# EAGLE design M701D (EAGLE 6.6.0)
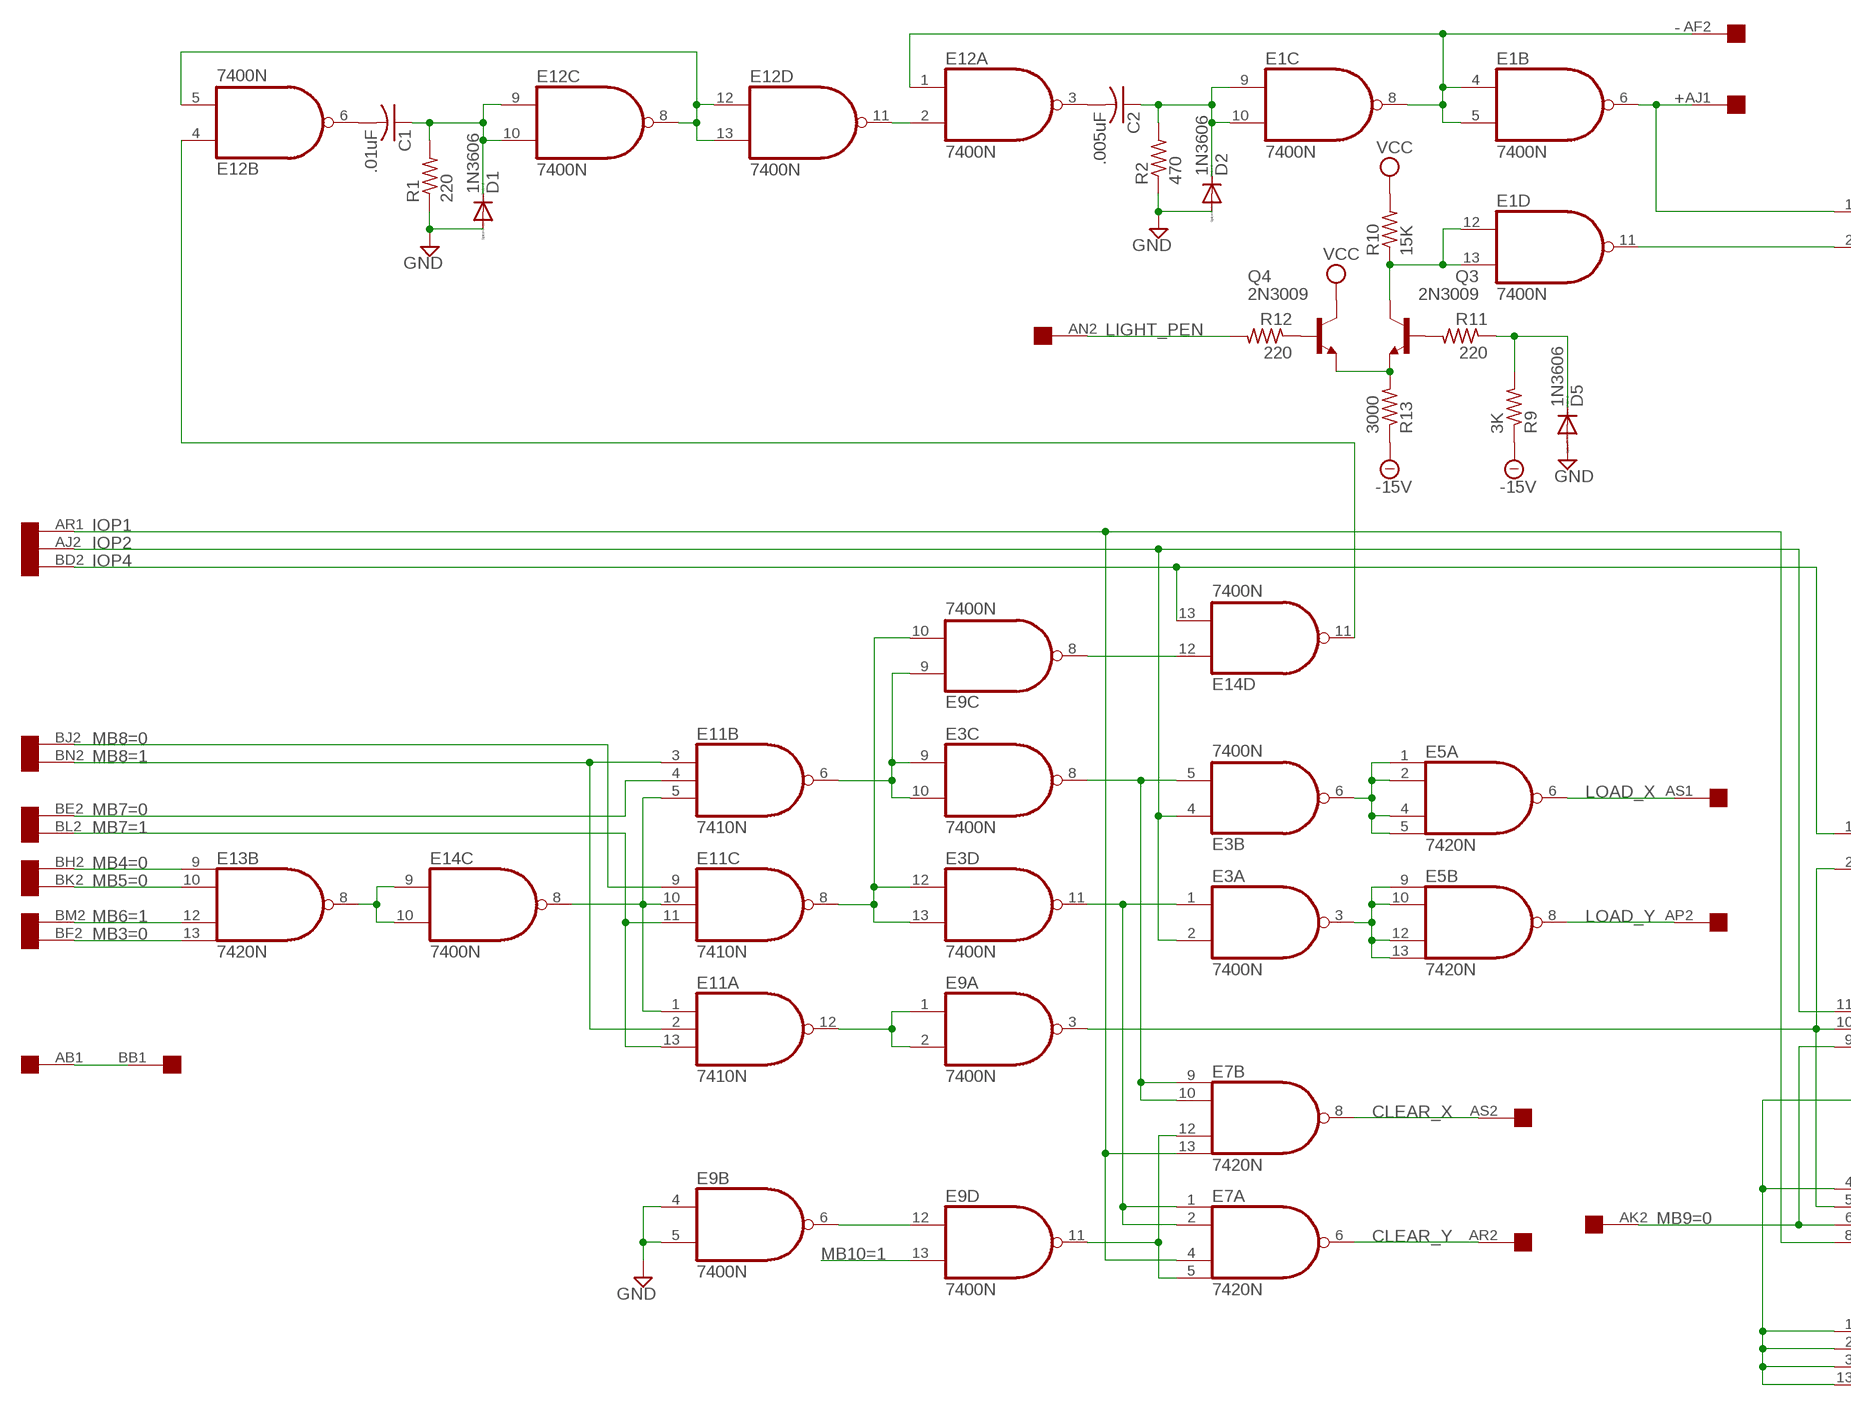
[diagram p0: schematic, sheet 1, part 1 of 2]
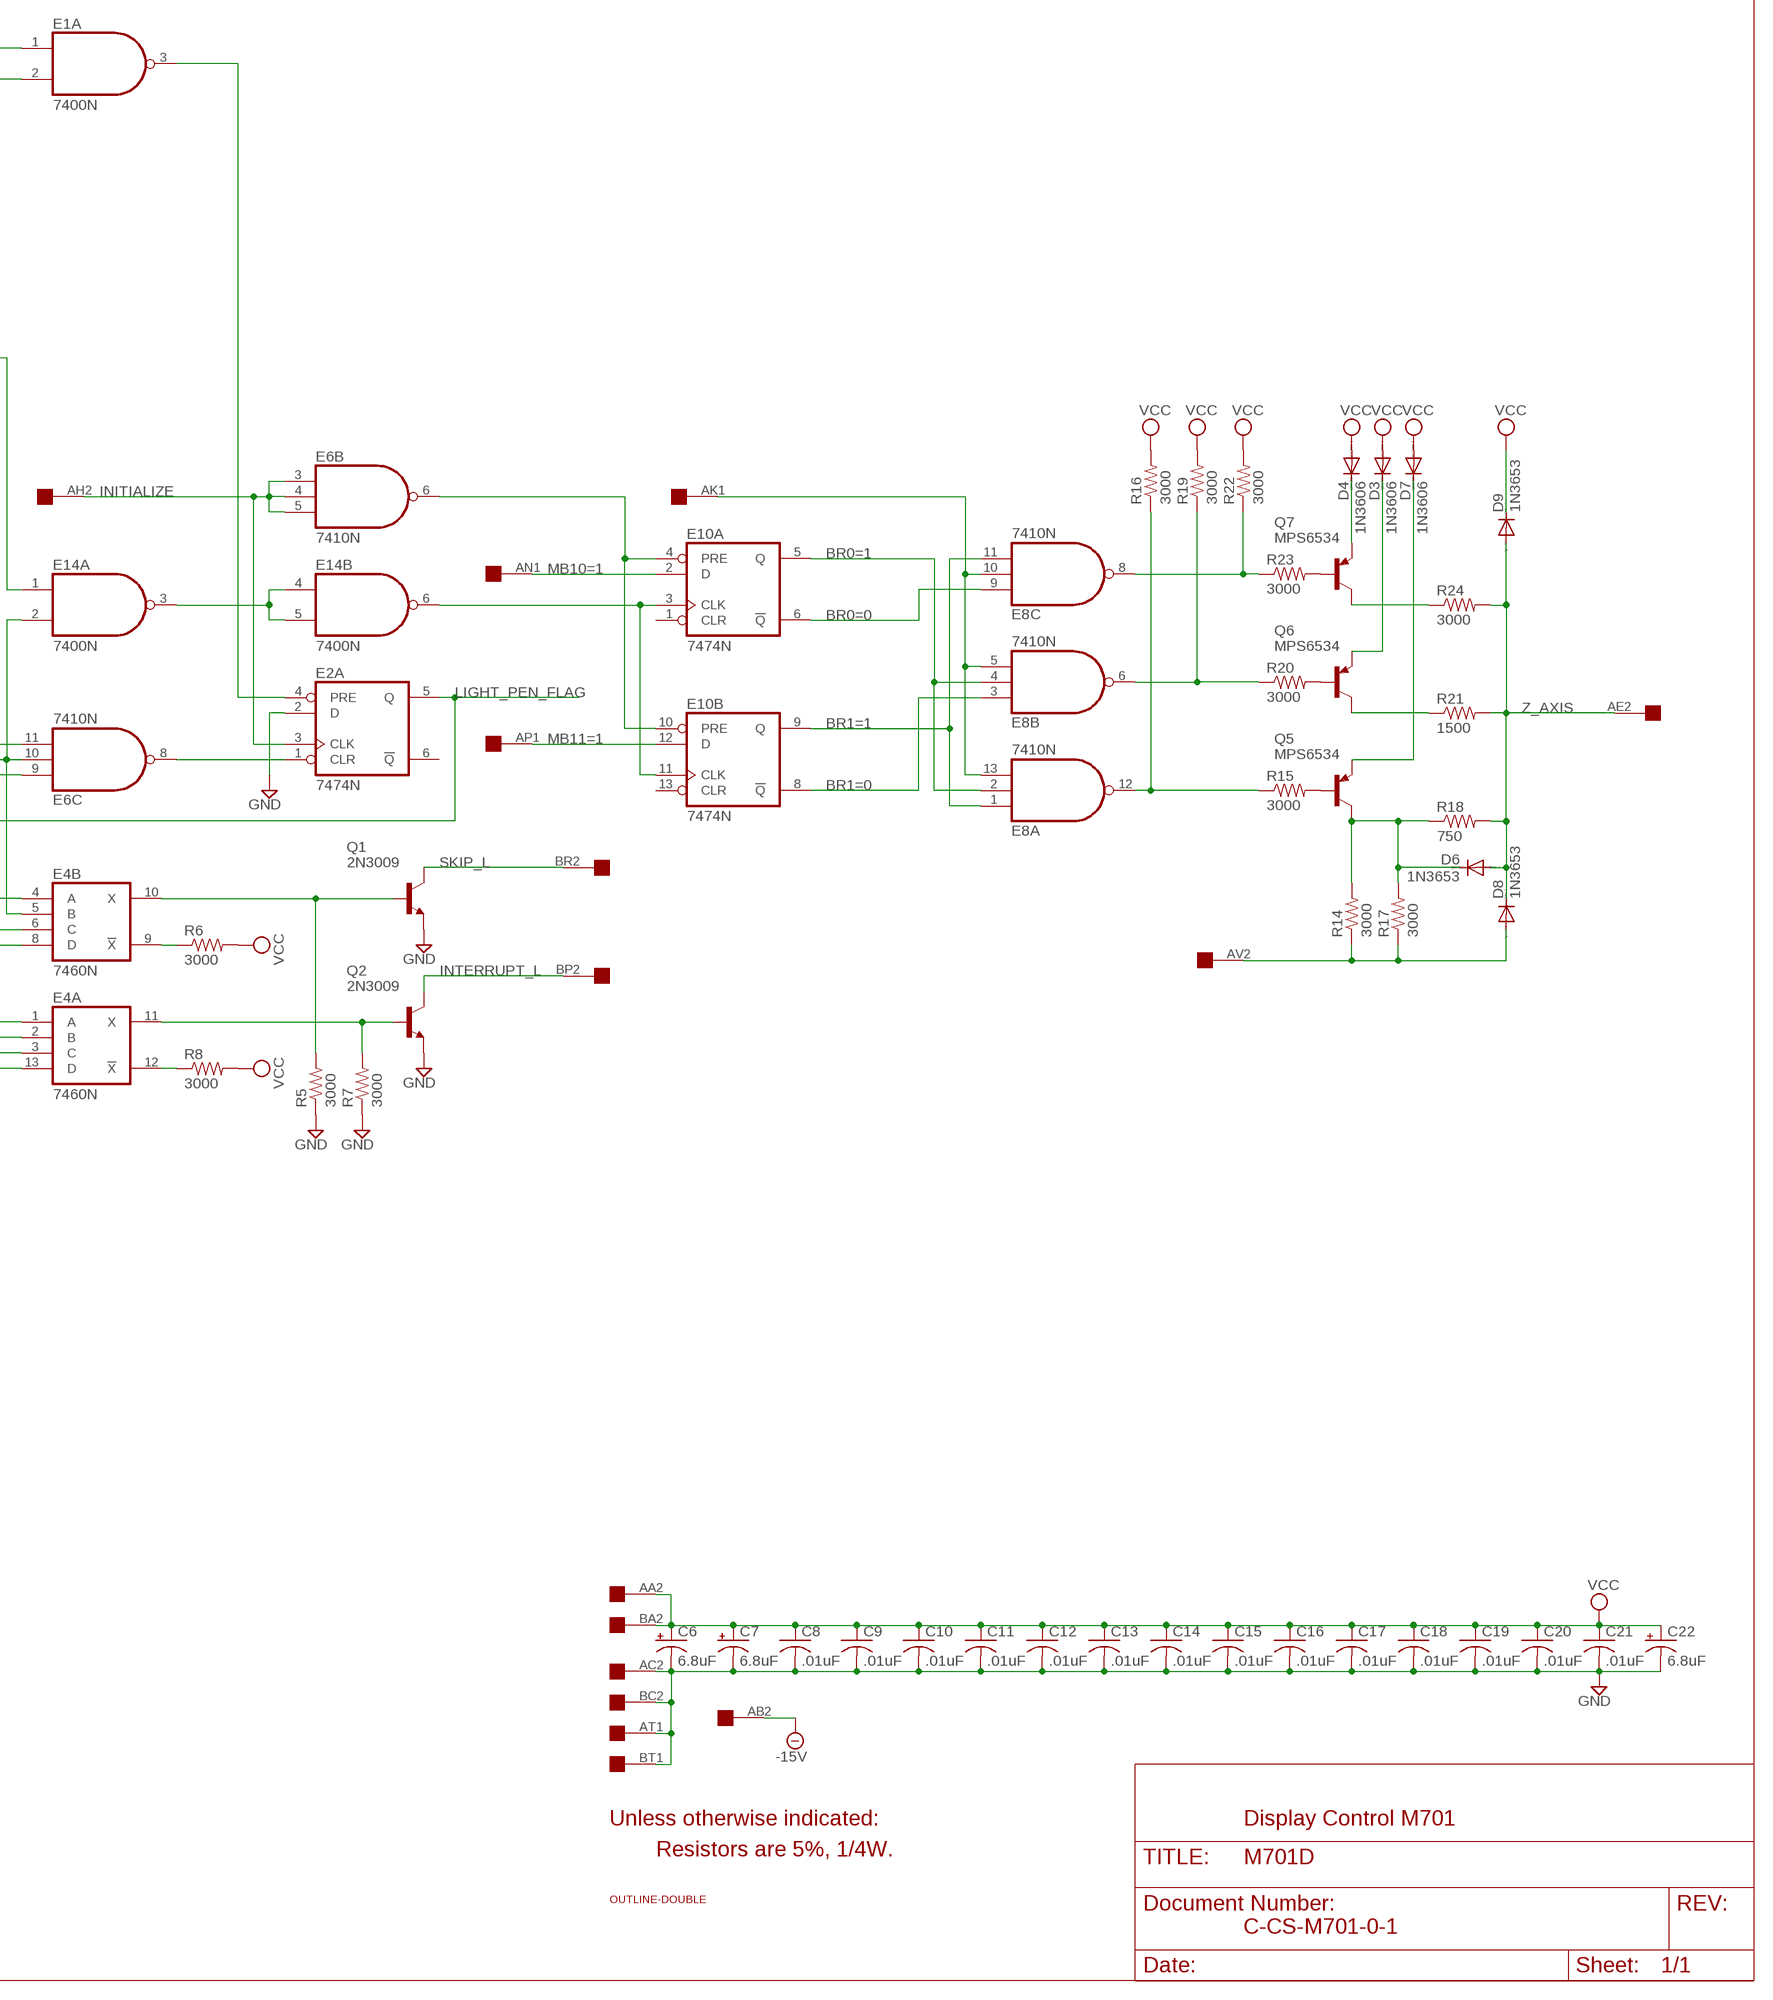
[diagram p1: schematic, sheet 1, part 2 of 2]

## Parts
C1  .01uF  C-US050-025X075  [C050-025X075]
C2  .005uF  C-US050-025X075  [C050-025X075]
C6  6.8uF  CPOL-USE20-8AXIAL  [E12-8]
C7  6.8uF  CPOL-USE20-8AXIAL  [E12-8]
C8  .01uF  C-US050-025X075  [C050-025X075]
C9  .01uF  C-US050-025X075  [C050-025X075]
C10  .01uF  C-US050-025X075  [C050-025X075]
C11  .01uF  C-US050-025X075  [C050-025X075]
C12  .01uF  C-US050-025X075  [C050-025X075]
C13  .01uF  C-US050-025X075  [C050-025X075]
C14  .01uF  C-US050-025X075  [C050-025X075]
C15  .01uF  C-US050-025X075  [C050-025X075]
C16  .01uF  C-US050-025X075  [C050-025X075]
C17  .01uF  C-US050-025X075  [C050-025X075]
C18  .01uF  C-US050-025X075  [C050-025X075]
C19  .01uF  C-US050-025X075  [C050-025X075]
C20  .01uF  C-US050-025X075  [C050-025X075]
C21  .01uF  C-US050-025X075  [C050-025X075]
C22  6.8uF  CPOL-USE20-8AXIAL  [E12-8]
D1  1N3606  1N4148DO35-10  [DO35-10]
D2  1N3606  1N4148DO35-10  [DO35-10]
D3  1N3606  1N4148DO35-10  [DO35-10]
D4  1N3606  1N4148DO35-10  [DO35-10]
D5  1N3606  1N4148DO35-10  [DO35-10]
D6  1N3653  1N4148DO35-10  [DO35-10]
D7  1N3606  1N4148DO35-10  [DO35-10]
D8  1N3653  1N4148DO35-10  [DO35-10]
D9  1N3653  1N4148DO35-10  [DO35-10]
E1  7400N  [DIL14]
E2  7474N  74S74N  [DIL14]
E3  7400N  [DIL14]
E4  7460N  [DIL14]
E5  7420N  74S20N  [DIL14]
E6  7410N  [DIL14]
E7  7420N  74S20N  [DIL14]
E8  7410N  [DIL14]
E9  7400N  [DIL14]
E10  7474N  74S74N  [DIL14]
E11  7410N  [DIL14]
E12  7400N  [DIL14]
E13  7420N  74S20N  [DIL14]
E14  7400N  [DIL14]
Q1  2N3009  2N2102  [TO5]
Q2  2N3009  2N2102  [TO5]
Q3  2N3009  2N2102  [TO5]
Q4  2N3009  2N2102  [TO5]
Q5  MPS6534  2N2905  [TO5]
Q6  MPS6534  2N2905  [TO5]
Q7  MPS6534  2N2905  [TO5]
R1  220  R-US_0207/10  [0207/10]
R2  470  R-US_0207/10  [0207/10]
R5  3000  R-US_0207/10  [0207/10]
R6  3000  R-US_0207/10  [0207/10]
R7  3000  R-US_0207/10  [0207/10]
R8  3000  R-US_0207/10  [0207/10]
R9  3K  R-US_0207/10  [0207/10]
R10  15K  R-US_0207/10  [0207/10]
R11  220  R-US_0207/10  [0207/10]
R12  220  R-US_0207/10  [0207/10]
R13  3000  R-US_0207/10  [0207/10]
R14  3000  R-US_0207/10  [0207/10]
R15  3000  R-US_0207/10  [0207/10]
R16  3000  R-US_0207/10  [0207/10]
R17  3000  R-US_0207/10  [0207/10]
R18  750  R-US_0207/10  [0207/10]
R19  3000  R-US_0207/10  [0207/10]
R20  3000  R-US_0207/10  [0207/10]
R21  1500  R-US_0207/10  [0207/10]
R22  3000  R-US_0207/10  [0207/10]
R23  3000  R-US_0207/10  [0207/10]
R24  3000  R-US_0207/10  [0207/10]
U$1  DOUBLE  [EDGE-CON4]
U$2  OUTLINE-DOUBLE  [DOUBLE]

## Nets
+: E1.1(A:I0) E1.6(B:O) U$1.AJ1
-: E1.4(B:I0) E1.5(B:I1) E1.8(C:O) E12.1(A:I0) U$1.AF2
-15V: R9.1 R13.1 U$1.AB2
BR0=0: E8.9(C:I0) E10.6(A:!Q)
BR0=1: E8.2(A:I1) E8.4(B:I1) E10.5(A:Q)
BR1=0: E8.3(B:I0) E10.8(B:!Q)
BR1=1: E8.1(A:I0) E8.11(C:I2) E10.9(B:Q)
CLEAR_X: E7.8(B:O) U$1.AS2
CLEAR_Y: E7.6(A:O) U$1.AR2
GND [Supply]: C6.- C7.- C8.2 C9.2 C10.2 C11.2 C12.2 C13.2 C14.2 C15.2 C16.2 C17.2 C18.2 C19.2 C20.2 C21.2 C22.- D1.A D2.A D5.A E2.2(A:D) E9.4(B:I0) E9.5(B:I1) Q1.1(E) Q2.1(E) R1.1 R2.1 R5.1 R7.1 U$1.AC2 U$1.AT1 U$1.BC2 U$1.BT1
INITIALIZE: E2.3(A:CLK) E6.3(B:I0) E6.4(B:I1) E6.5(B:I2) U$1.AH2
INTERRUPT_L: Q2.3(C) U$1.BP2
IOP1: E4.8(B:D) E7.4(A:I2) E7.13(B:I3) U$1.AR1
IOP2: E3.2(A:I1) E3.4(B:I0) E6.11(C:I2) U$1.AJ2
IOP4: E14.1(A:I0) E14.13(D:I1) U$1.BD2
LIGHT_PEN: R12.2 U$1.AN2
LIGHT_PEN_FLAG: E2.5(A:Q) E4.1(A:A) E4.2(A:B) E4.3(A:C) E4.4(B:A) E4.13(A:D)
LOAD_X: E5.6(A:O) U$1.AS1
LOAD_Y: E5.8(B:O) U$1.AP2
MB3=0: E13.13(B:I3) U$1.BF2
MB4=0: E13.9(B:I0) U$1.BH2
MB5=0: E13.10(B:I1) U$1.BK2
MB6=1: E13.12(B:I2) U$1.BM2
MB7=0: E11.4(B:I1) U$1.BE2
MB7=1: E11.11(C:I2) E11.13(A:I2) U$1.BL2
MB8=0: E11.9(C:I0) U$1.BJ2
MB8=1: E11.2(A:I1) E11.3(B:I0) U$1.BN2
MB9=0: E4.6(B:C) E6.9(C:I0) U$1.AK2
MB10=1: E9.13(D:I1) E10.2(A:D) U$1.AN1
MB11=1: E10.12(B:D) U$1.AP1
N$1: E13.8(B:O) E14.9(C:I0) E14.10(C:I1)
N$2: E11.1(A:I0) E11.5(B:I2) E11.10(C:I1) E14.8(C:O)
N$3: E9.1(A:I0) E9.2(A:I1) E11.12(A:O)
N$4: E3.12(D:I0) E3.13(D:I1) E9.10(C:I1) E11.8(C:O)
N$5: E3.9(C:I0) E3.10(C:I1) E9.9(C:I0) E11.6(B:O)
N$6: E3.5(B:I1) E3.8(C:O) E7.9(B:I0) E7.10(B:I1)
N$7: E3.1(A:I0) E3.11(D:O) E7.1(A:I0) E7.2(A:I1)
N$8: E4.12(A:!X) R8.1
N$9: E3.6(B:O) E5.1(A:I0) E5.2(A:I1) E5.4(A:I2) E5.5(A:I3)
N$10: E3.3(A:O) E5.9(B:I0) E5.10(B:I1) E5.12(B:I2) E5.13(B:I3)
N$11: E9.8(C:O) E14.12(D:I0)
N$12: E14.3(A:O) E14.4(B:I0) E14.5(B:I1)
N$13: E1.3(A:O) E2.4(A:PRE)
N$14: E1.12(D:I0) E1.13(D:I1) Q3.3(C) R10.1
N$15: E4.5(B:B) E6.10(C:I1) E9.3(A:O) E14.2(A:I1)
N$16: E2.1(A:CLR) E6.8(C:O)
N$17: Q3.1(E) Q4.1(E) R13.2
N$18: E4.9(B:!X) R6.1
N$19: E4.10(B:X) Q1.2(B) R5.2
N$20: E4.11(A:X) Q2.2(B) R7.2
N$21: E10.3(A:CLK) E10.11(B:CLK) E14.6(B:O)
N$22: E6.6(B:O) E10.4(A:PRE) E10.10(B:PRE)
N$23: Q3.2(B) R11.2
N$24: E8.5(B:I2) E8.10(C:I1) E8.13(A:I2) U$1.AK1
N$25: E1.2(A:I1) E1.11(D:O)
N$26: C2.1 D2.C E1.9(C:I0) E1.10(C:I1) R2.2
N$27: C2.2 E12.3(A:O)
N$28: D5.C R9.2 R11.1
N$29: Q4.2(B) R12.1
N$30: E12.2(A:I1) E12.11(D:O)
N$31: E12.5(B:I1) E12.8(C:O) E12.12(D:I0) E12.13(D:I1)
N$32: C1.1 D1.C E12.9(C:I0) E12.10(C:I1) R1.2
N$33: C1.2 E12.6(B:O)
N$34: Q7.2(B) R23.2
N$35: Q6.2(B) R20.2
N$36: E12.4(B:I0) E14.11(D:O)
N$37: Q5.2(B) R15.2
N$38: E8.12(A:O) R15.1 R16.1
N$39: E8.6(B:O) R19.1 R20.1
N$40: E8.8(C:O) R22.1 R23.1
N$41: D4.C Q7.1(E)
N$42: D3.C Q6.1(E)
N$43: D7.C Q5.1(E)
N$44: D6.C Q5.3(C) R14.2 R17.2 R18.1
N$45: Q6.3(C) R21.1
N$46: Q7.3(C) R24.1
N$47: E7.5(A:I3) E7.12(B:I2) E9.11(D:O)
N$48: D8.A R14.1 R17.1 U$1.AV2
N$49: E9.6(B:O) E9.12(D:I0)
N$50: U$1.AB1 U$1.BB1
SKIP_L: Q1.3(C) U$1.BR2
VCC [Supply]: C6.+ C7.+ C8.1 C9.1 C10.1 C11.1 C12.1 C13.1 C14.1 C15.1 C16.1 C17.1 C18.1 C19.1 C20.1 C21.1 C22.+ D3.A D4.A D7.A D9.C Q4.3(C) R6.2 R8.2 R10.2 R16.2 R19.2 R22.2 U$1.AA2 U$1.BA2
Z_AXIS: D6.A D8.C D9.A R18.2 R21.2 R24.2 U$1.AE2
Unconnected: E2.6(A:!Q) E2.8(B:!Q) E2.9(B:Q) E2.10(B:PRE) E2.11(B:CLK) E2.12(B:D) E2.13(B:CLR) E6.1(A:I0) E6.2(A:I1) E6.12(A:O) E6.13(A:I2) E10.1(A:CLR) E10.13(B:CLR) E13.1(A:I0) E13.2(A:I1) E13.4(A:I2) E13.5(A:I3) E13.6(A:O) U$1.AA1 U$1.AC1 U$1.AD1 U$1.AD2 U$1.AE1 U$1.AF1 U$1.AH1 U$1.AL1 U$1.AL2 U$1.AM1 U$1.AM2 U$1.AT2 U$1.AU1 U$1.AU2 U$1.AV1 U$1.BA1 U$1.BB2 U$1.BC1 U$1.BD1 U$1.BE1 U$1.BF1 U$1.BH1 U$1.BJ1 U$1.BK1 U$1.BL1 U$1.BM1 U$1.BN1 U$1.BP1 U$1.BR1 U$1.BS1 U$1.BS2 U$1.BT2 U$1.BU1 U$1.BU2 U$1.BV1 U$1.BV2

## Notes on the sheet
- Unless otherwise indicated: | Display Control M701
- Resistors are 5%, 1/4W.
- C-CS-M701-0-1

## Power pins joined to a net without a drawn wire
GND: E1.7(P:GND) E2.7(P:GND) E3.7(P:GND) E4.7(P:GND) E5.7(P:GND) E6.7(P:GND) E7.7(P:GND) E8.7(P:GND) E9.7(P:GND) E10.7(P:GND) E11.7(P:GND) E12.7(P:GND) E13.7(P:GND) E14.7(P:GND)
VCC: E1.14(P:VCC) E2.14(P:VCC) E3.14(P:VCC) E4.14(P:VCC) E5.14(P:VCC) E6.14(P:VCC) E7.14(P:VCC) E8.14(P:VCC) E9.14(P:VCC) E10.14(P:VCC) E11.14(P:VCC) E12.14(P:VCC) E13.14(P:VCC) E14.14(P:VCC)

## Library data of the parts
C1 C2 C8-C21 = rcl:C-US: CAPACITOR, American symbol
C6 C7 C22 = dec-con:CPOL-USE20-8AXIAL: A 0.8 inch electrolytic.
D1-D9 = diode:1N4148: DIODE high speed (Philips)
E1 E3 E9 E12 E14 = 74xx-us:74*00: Quad 2-input NAND gate
E2 E10 = 74xx-us:74*74: Dual D type positive edge triggered FLIP FLOP, preset and clear
E4 = 74xx-us:74*60: Dual 4-input EXPANDER
E5 E7 E13 = 74xx-us:74*20: Dual 4-input NAND gate
E6 E8 E11 = 74xx-us:74*10: Triple 3-input NAND gate
Q1-Q4 = transistor-npn:2N2102: NPN Transistor
Q5-Q7 = transistor-pnp:2N2905: PNP Transistor
R1 R2 R5-R24 = rcl:R-US_: RESISTOR, American symbol
U$1 = dec-con:DOUBLE: Double-Height DEC board
U$2 = dec-con:OUTLINE-*: Board outlines for DEC boards.

## Net classes
1 Supply: width 0.813 mm

## Board
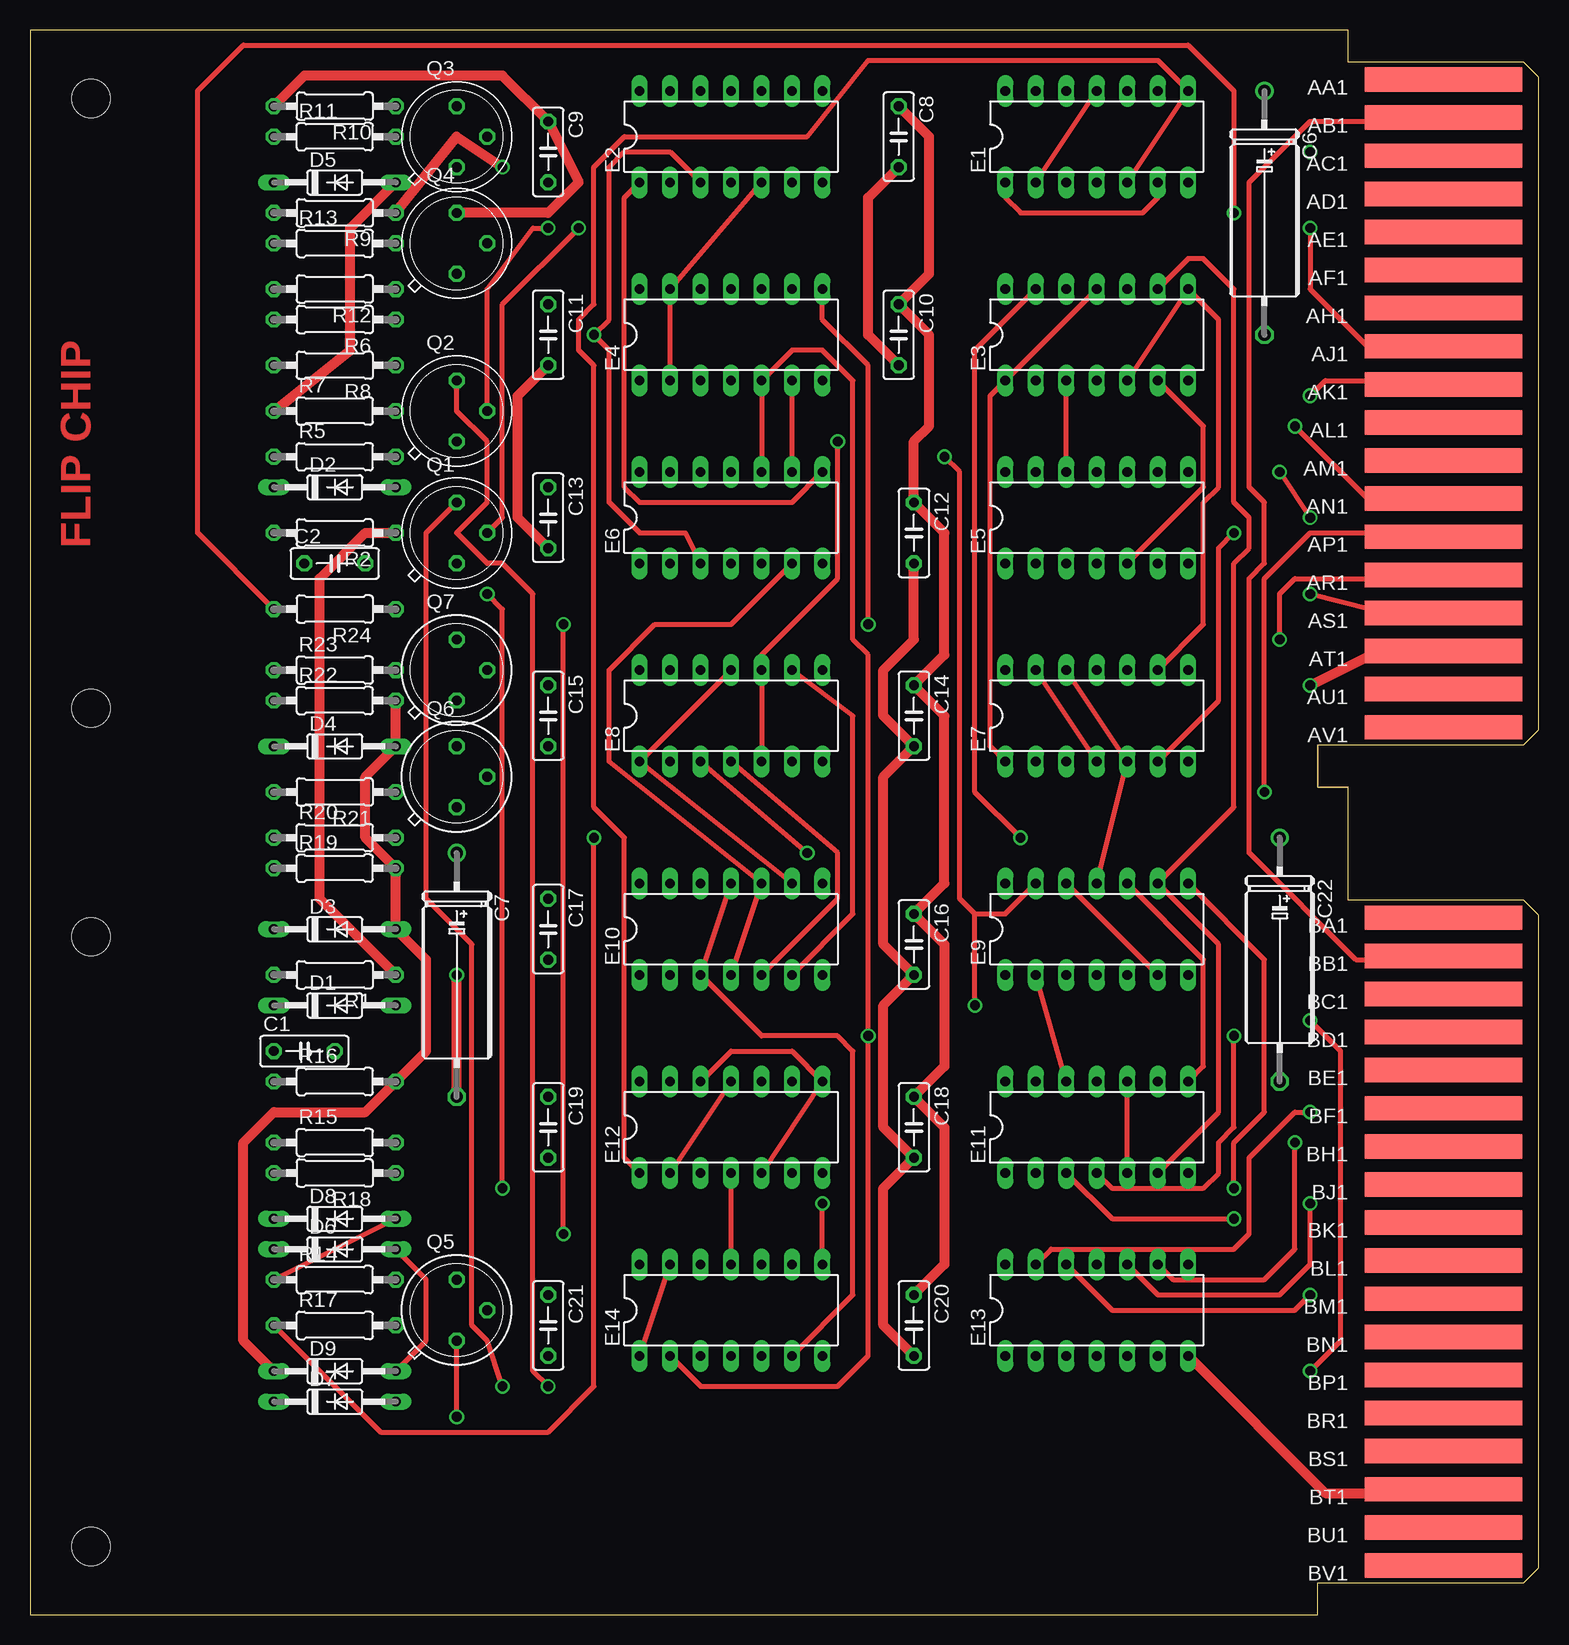
[diagram p2: board, top side]
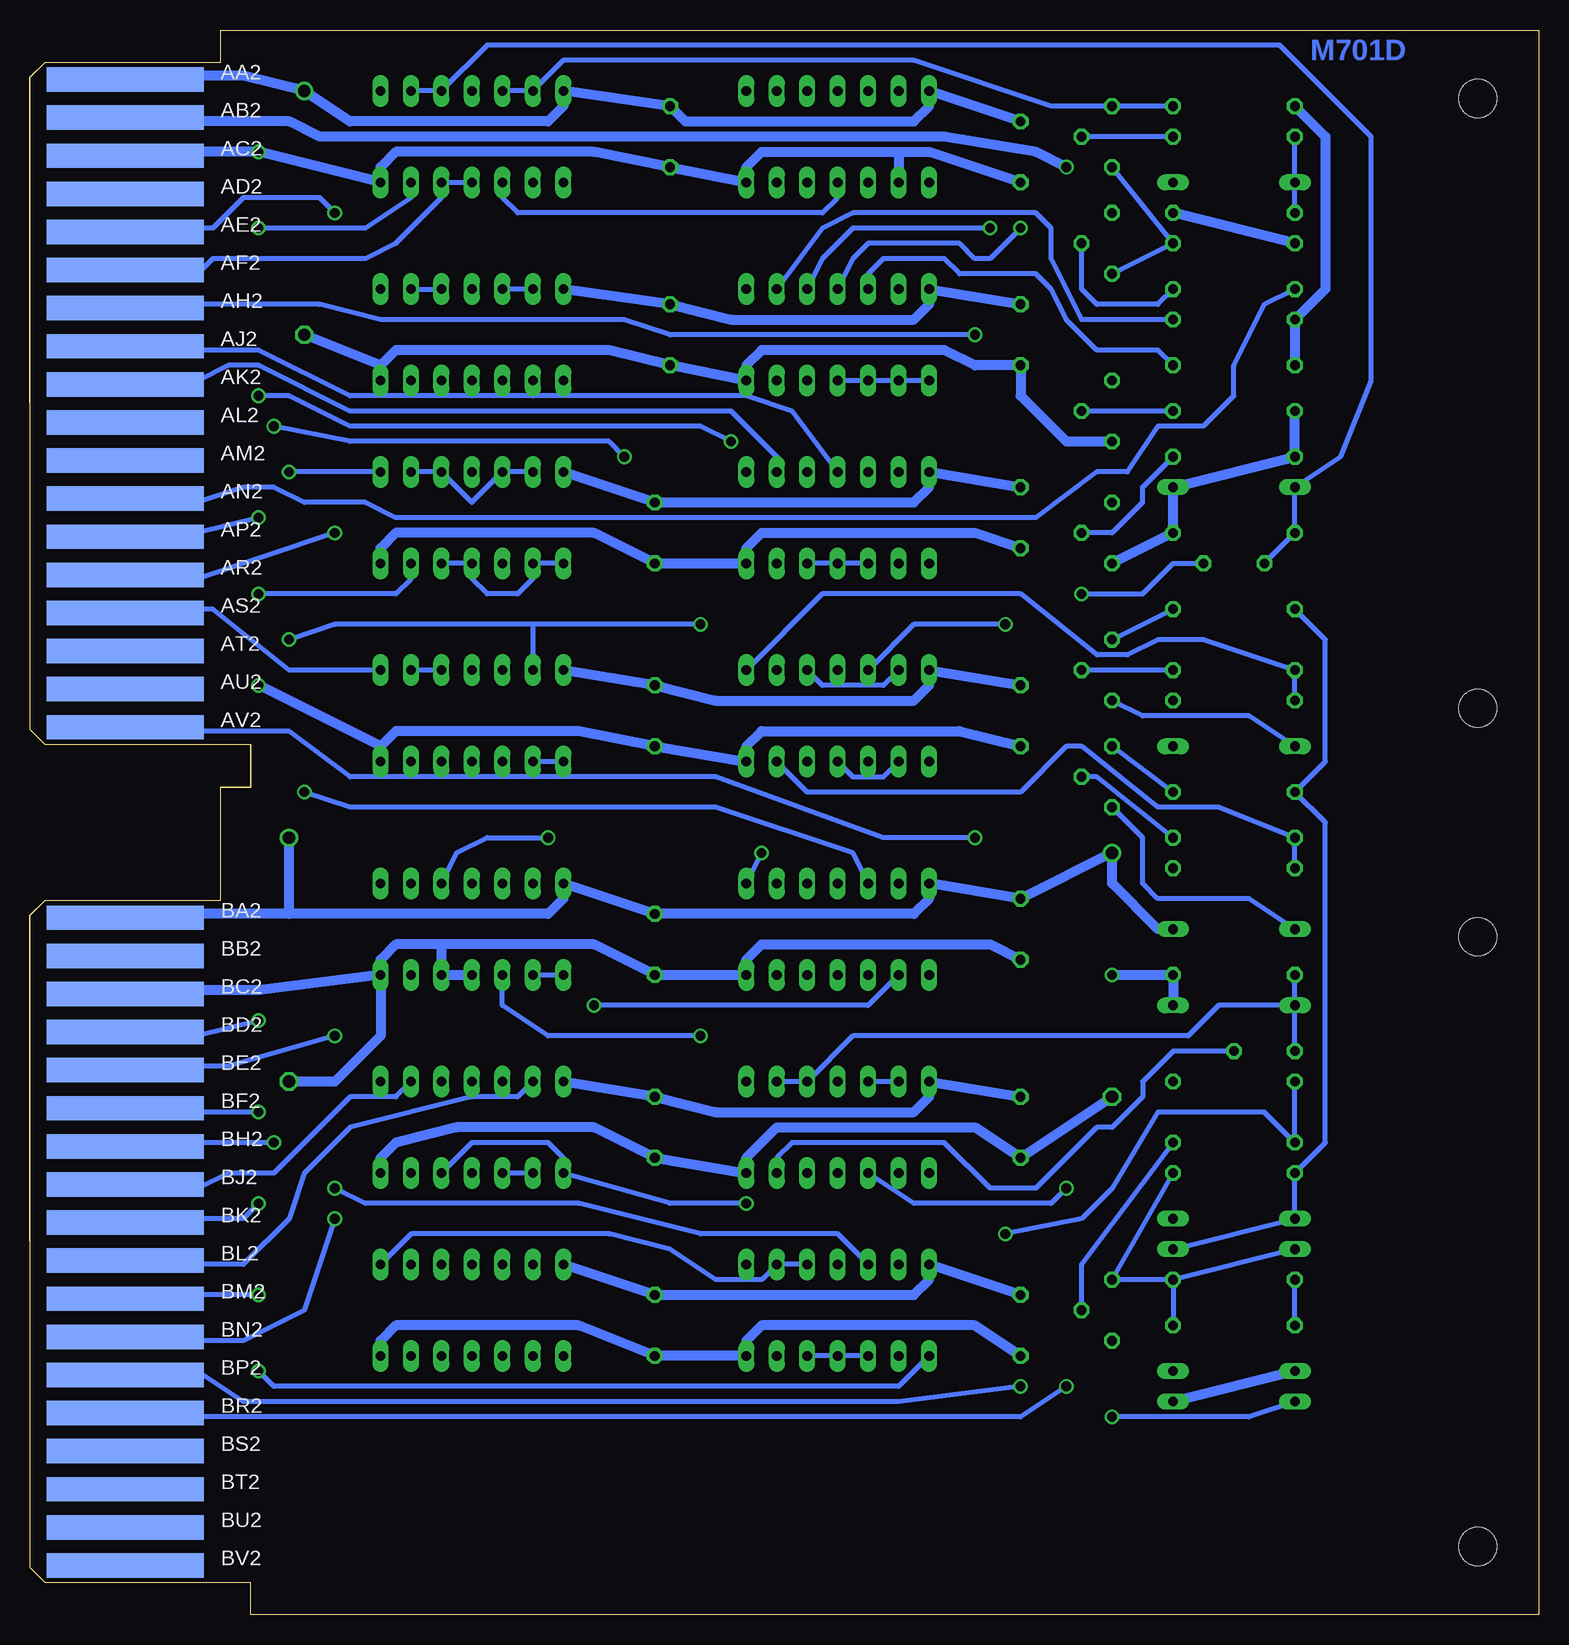
[diagram p3: board, bottom side, seen from below]

Size 125.73 x 132.08 mm. Coordinates in mm from the lower left corner, seen from the top.
Copper layers (1+16): Top 0.035mm / dielectric 1.5mm / Bottom 0.035mm
Design rules "16mils": minimum track width 16mil, minimum drill 32mil, track to track 15mil, track to pad 10mil, pad to pad 10mil, via to via 10mil, smd to smd 10mil, copper to edge 13mil, drill to drill 10mil, minimum pad ring 10mil, minimum via ring 8mil, stop-mask expansion 0mil, vias tented up to drill 0mil, thermal gap 10mil

### Footprints (pad centres in the part's own frame; a part is rotated, then mirrored left to right if it is on the bottom)
C050-025X075 = drill 0.813 octagon: 1 -2.54,0; 2 2.54,0
E12-8 = drill 1.016: + -10.16,0 | drill 1.016 octagon: - 10.16,0
DO35-10 = drill 0.813 long: A 5.08,0; C -5.08,0
DIL14 = drill 0.813 long: 1 -7.62,-3.81; 2 -5.08,-3.81; 3 -2.54,-3.81; 4 0,-3.81; 5 2.54,-3.81; 6 5.08,-3.81; 7 7.62,-3.81; 8 7.62,3.81; 9 5.08,3.81; 10 2.54,3.81; 11 0,3.81; 12 -2.54,3.81; 13 -5.08,3.81; 14 -7.62,3.81
TO5 = drill 0.813 octagon: 1 0,-2.54; 2 2.54,0; 3 0,2.54
0207/10 = drill 0.813 octagon: 1 -5.08,0; 2 5.08,0
EDGE-CON4 = smd 13.106 x 2.032: AA1 7.938,4.128; AB1 7.938,7.303; AC1 7.938,10.477; AD1 7.938,13.652; AE1 7.938,16.828; AF1 7.938,20.003; AH1 7.938,23.177; AJ1 7.938,26.352; AK1 7.938,29.527; AL1 7.938,32.703; AM1 7.938,35.877; AN1 7.938,39.053; AP1 7.938,42.227; AR1 7.938,45.403; AS1 7.938,48.578; AT1 7.938,51.752; AU1 7.938,54.928; AV1 7.938,58.102; BA1 7.938,73.978; BB1 7.938,77.153; BC1 7.938,80.328; BD1 7.938,83.502; BE1 7.938,86.677; BF1 7.938,89.853; BH1 7.938,93.028; BJ1 7.938,96.203; BK1 7.938,99.377; BL1 7.938,102.552; BM1 7.938,105.728; BN1 7.938,108.903; BP1 7.938,112.078; BR1 7.938,115.252; BS1 7.938,118.427; BT1 7.938,121.603; BU1 7.938,124.778; BV1 7.938,127.953 | smd 13.106 x 2.032 bottom: AA2 7.938,4.128; AB2 7.938,7.303; AC2 7.938,10.477; AD2 7.938,13.652; AE2 7.938,16.828; AF2 7.938,20.003; AH2 7.938,23.177; AJ2 7.938,26.352; AK2 7.938,29.527; AL2 7.938,32.703; AM2 7.938,35.877; AN2 7.938,39.053; AP2 7.938,42.227; AR2 7.938,45.403; AS2 7.938,48.578; AT2 7.938,51.752; AU2 7.938,54.928; AV2 7.938,58.102; BA2 7.938,73.978; BB2 7.938,77.153; BC2 7.938,80.328; BD2 7.938,83.502; BE2 7.938,86.677; BF2 7.938,89.853; BH2 7.938,93.028; BJ2 7.938,96.203; BK2 7.938,99.377; BL2 7.938,102.552; BM2 7.938,105.728; BN2 7.938,108.903; BP2 7.938,112.078; BR2 7.938,115.252; BS2 7.938,118.427; BT2 7.938,121.603; BU2 7.938,124.778; BV2 7.938,127.953
DOUBLE = hole 3.175: 120.65,56.515; 120.65,5.715; 120.65,75.565; 120.65,126.365

### Placement (x,y rotation side)
C1  22.86,46.99 0 top
C2  25.4,87.63 0 top
C6  102.87,116.84 270 top
C7  35.56,53.34 270 top
C8  72.39,123.19 270 top
C9  43.18,121.92 270 top
C10  72.39,106.68 270 top
C11  43.18,106.68 270 top
C12  73.66,90.17 270 top
C13  43.18,91.44 270 top
C14  73.66,74.93 270 top
C15  43.18,74.93 270 top
C16  73.66,55.88 270 top
C17  43.18,57.15 270 top
C18  73.66,40.64 270 top
C19  43.18,40.64 270 top
C20  73.66,24.13 270 top
C21  43.18,24.13 270 top
C22  104.14,54.61 270 top
D1  25.4,50.8 0 top
D2  25.4,93.98 0 top
D3  25.4,57.15 0 top
D4  25.4,72.39 0 top
D5  25.4,119.38 0 top
D6  25.4,30.48 0 top
D7  25.4,17.78 0 top
D8  25.4,33.02 0 top
D9  25.4,20.32 0 top
E1  88.9,123.19 0 top
E2  58.42,123.19 0 top
E3  88.9,106.68 0 top
E4  58.42,106.68 0 top
E5  88.9,91.44 0 top
E6  58.42,91.44 0 top
E7  88.9,74.93 0 top
E8  58.42,74.93 0 top
E9  88.9,57.15 0 top
E10  58.42,57.15 0 top
E11  88.9,40.64 0 top
E12  58.42,40.64 0 top
E13  88.9,25.4 0 top
E14  58.42,25.4 0 top
Q1  35.56,90.17 0 top
Q2  35.56,100.33 0 top
Q3  35.56,123.19 0 top
Q4  35.56,114.3 0 top
Q5  35.56,25.4 0 top
Q6  35.56,69.85 0 top
Q7  35.56,78.74 0 top
R1  25.4,53.34 180 top
R2  25.4,90.17 180 top
R5  25.4,96.52 0 top
R6  25.4,107.95 180 top
R7  25.4,100.33 0 top
R8  25.4,104.14 180 top
R9  25.4,116.84 180 top
R10  25.4,125.73 180 top
R11  25.4,123.19 0 top
R12  25.4,110.49 180 top
R13  25.4,114.3 0 top
R14  25.4,27.94 0 top
R15  25.4,39.37 0 top
R16  25.4,44.45 0 top
R17  25.4,24.13 0 top
R18  25.4,36.83 180 top
R19  25.4,62.23 0 top
R20  25.4,64.77 0 top
R21  25.4,68.58 180 top
R22  25.4,76.2 0 top
R23  25.4,78.74 0 top
R24  25.4,83.82 180 top
U$1  125.73,132.08 180 top
U$2  125.73,132.08 180 top
U$4  [FLIPCHIP]  0,69.85 0 top

### Tracks (layer width: path | path; a pad name or v marks a point on that pad's centre or on a via)
+  (via drill 0.81)
  Top 0.406: U$1.AJ1 116.84,105.41 111.76,105.41 106.68,110.49 v106.68,115.57 | E1.1 81.28,118.11 82.55,116.84 92.71,116.84 93.98,118.11 E1.6
  Bottom 0.406: E1.6 93.98,118.11 97.79,115.57 v106.68,115.57
-
  Top 0.406: E12.1 49.53,38.1 49.53,64.77 46.99,67.31 46.99,104.14 45.72,105.41 45.72,107.95 46.99,109.22 46.99,120.65 49.53,123.19 64.77,123.19 69.85,129.54 93.98,129.54 E1.8 E1.5
  Bottom 0.406: U$1.AF2 116.84,111.76 111.76,111.76 110.49,113.03 97.79,113.03 95.25,114.3 91.44,118.11 E1.5 E1.4
-15V  (via drill 0.81)
  Top 0.813: R9.1 35.56,123.19 v39.37,120.65
  Bottom 0.813: U$1.AB2 116.84,124.46 104.14,124.46 101.6,123.19 49.53,123.19 41.91,121.92 v39.37,120.65 | R13.1 R9.1
BR0=0
  Top 0.406: E10.6 68.58,58.42 68.58,74.93 E8.9
BR0=1
  Top 0.406: E10.5 67.31,59.69 67.31,63.5 E8.4
  Bottom 0.406: E8.2 54.61,69.85 57.15,69.85 E8.4
BR1=0  (via drill 0.81)
  Top 0.406: E8.3 v64.77,63.5
  Bottom 0.406: v64.77,63.5 E10.8
BR1=1
  Top 0.406: E10.9 E8.1 E8.11
CLEAR_X
  Bottom 0.406: E7.8 104.14,78.74 110.49,83.82 116.84,83.82 U$1.AS2
CLEAR_Y  (via drill 0.81)
  Top 0.406: E7.6 99.06,76.2 99.06,88.9 v100.33,90.17
  Bottom 0.406: U$1.AR2 116.84,86.36 111.76,86.36 v100.33,90.17
GND  (via drill 0.81)
  Top 0.813: D5.A 26.67,115.57 26.67,105.41 R7.1 | C10.2 69.85,106.68 69.85,118.11 C8.2 | C12.2 73.66,81.28 71.12,78.74 71.12,74.93 C14.2 71.12,69.85 71.12,55.88 C16.2 71.12,50.8 71.12,40.64 C18.2 71.12,35.56 71.12,24.13 C20.2 | U$1.BT1 116.84,10.16 107.95,10.16 E13.7 | C7.- v35.56,53.34 | U$1.AT1 116.84,80.01 111.76,80.01 v106.68,77.47 | C13.2 40.64,91.44 40.64,101.6 C11.2 | R2.1 27.94,90.17 24.13,86.36 24.13,59.69 R1.1
  Bottom 0.813: Q2.1 39.37,97.79 43.18,101.6 C11.2 46.99,104.14 49.53,105.41 64.77,105.41 66.04,104.14 E4.7 C10.2 77.47,105.41 95.25,105.41 96.52,104.14 | 96.52,104.14 E3.7 | 96.52,104.14 C6.- | C9.2 50.8,121.92 53.34,121.92 | 53.34,121.92 64.77,121.92 66.04,120.65 E2.7 C8.2 78.74,121.92 95.25,121.92 96.52,120.65 E1.7 v106.68,121.92 116.84,121.92 U$1.AC2 | 53.34,121.92 E2.2 | C7.- C19.2 46.99,40.64 63.5,40.64 66.04,38.1 E12.7 C18.2 78.74,40.64 90.17,40.64 95.25,39.37 96.52,38.1 E11.7 | C13.2 46.99,90.17 64.77,90.17 66.04,88.9 E6.7 C12.2 78.74,90.17 95.25,90.17 96.52,88.9 E5.7 | C17.2 45.72,55.88 64.77,55.88 66.04,54.61 E10.7 C16.2 78.74,55.88 91.44,55.88 | E13.7 96.52,22.86 95.25,24.13 80.01,24.13 C20.2 E14.7 66.04,22.86 64.77,24.13 46.99,24.13 C21.2 | E9.7 96.52,54.61 95.25,55.88 91.44,55.88 | 91.44,55.88 E9.5 E9.4 | C22.- 100.33,44.45 96.52,48.26 E9.7 | U$1.BC2 116.84,52.07 106.68,52.07 E9.7 | 96.52,72.39 E7.7 | 96.52,72.39 95.25,73.66 80.01,73.66 C14.2 E8.7 66.04,72.39 64.77,73.66 48.26,73.66 C15.2 | Q1.1 R2.1 D2.A R5.1 R7.1 | D1.A R1.1 v35.56,53.34 | 96.52,72.39 v106.68,77.47
INITIALIZE  (via drill 0.81)
  Top 0.406: E2.3 53.34,121.92 49.53,121.92 48.26,120.65 48.26,107.95 v46.99,106.68 48.26,105.41 48.26,92.71 50.8,90.17 54.61,90.17 E6.3
  Bottom 0.406: U$1.AH2 116.84,109.22 101.6,109.22 96.52,107.95 76.2,107.95 72.39,106.68 v46.99,106.68 | E6.3 E6.4 E6.5
INTERRUPT_L  (via drill 0.81)
  Top 0.406: v43.18,19.05 41.91,20.32 41.91,85.09 39.37,87.63 38.1,87.63 35.56,90.17 38.1,92.71 38.1,97.79 35.56,100.33 Q2.3
  Bottom 0.406: U$1.BP2 117.17,19.99 116.84,20.32 111.76,20.32 107.95,17.78 53.34,17.78 v43.18,19.05
IOP1  (via drill 0.81)
  Top 0.406: E4.8 66.04,107.95 69.85,104.14 v69.85,82.55 | E7.13 E7.4 | U$1.AR1 116.84,86.36 105.41,86.36 104.14,85.09 v104.14,81.28
  Bottom 0.406: v69.85,82.55 83.82,82.55 | 83.82,82.55 E7.13 | 83.82,82.55 100.33,82.55 v104.14,81.28
IOP2
  Bottom 0.406: U$1.AJ2 116.84,105.41 106.68,105.41 99.06,101.6 88.9,101.6 | 88.9,101.6 E3.4 | 83.82,101.6 E3.2 | 83.82,101.6 88.9,101.6 | 83.82,101.6 66.04,101.6 62.23,100.33 E6.11
IOP4  (via drill 0.81)
  Top 0.406: E14.1 E14.13 | v106.68,20.32 109.22,22.86 109.22,46.99 v106.68,49.53
  Bottom 0.406: E14.1 53.34,19.05 105.41,19.05 v106.68,20.32 | U$1.BD2 116.84,48.26 111.76,48.26 v106.68,49.53
LIGHT_PEN
  Bottom 0.406: U$1.AN2 116.84,92.71 111.76,92.71 107.95,93.98 105.41,93.98 102.87,92.71 97.79,92.71 95.25,91.44 41.91,91.44 36.83,95.25 34.29,95.25 31.75,99.06 27.94,99.06 25.4,101.6 25.4,104.14 22.86,109.22 R12.2
LIGHT_PEN_FLAG
  Top 0.406: E2.5 E4.13 E4.2
  Bottom 0.406: E4.1 E4.2 E4.3 E4.4
LOAD_X  (via drill 0.81)
  Top 0.406: U$1.AS1 116.84,83.82 111.76,83.82 v106.68,85.09
  Bottom 0.406: E5.6 93.98,86.36 95.25,85.09 v106.68,85.09
LOAD_Y  (via drill 0.81)
  Top 0.406: v104.14,95.25 v106.68,91.44
  Bottom 0.406: U$1.AP2 116.84,90.17 111.76,90.17 v106.68,91.44 | E5.8 v104.14,95.25
MB3=0  (via drill 0.81)
  Top 0.406: E13.13 85.09,30.48 100.33,30.48 101.6,31.75 101.6,38.1 105.41,41.91 v106.68,41.91
  Bottom 0.406: U$1.BF2 116.84,41.91 v106.68,41.91
MB4=0  (via drill 0.81)
  Top 0.406: E13.9 95.25,27.94 102.87,27.94 105.41,30.48 v105.41,39.37
  Bottom 0.406: U$1.BH2 116.84,39.37 v105.41,39.37
MB5=0  (via drill 0.81)
  Top 0.406: E13.10 93.98,26.67 104.14,26.67 106.68,29.21 v106.68,34.29
  Bottom 0.406: U$1.BK2 116.84,33.02 107.95,33.02 v106.68,34.29
MB6=1  (via drill 0.81)
  Top 0.406: v106.68,26.67 105.41,25.4 90.17,25.4 E13.12
  Bottom 0.406: U$1.BM2 116.84,26.67 v106.68,26.67
MB7=0  (via drill 0.81)
  Top 0.406: E11.4 90.17,35.56 97.79,35.56 99.06,36.83 99.06,39.37 100.33,40.64 v100.33,48.26
  Bottom 0.406: U$1.BE2 116.84,45.72 109.22,45.72 v100.33,48.26
MB7=1
  Bottom 0.406: U$1.BL2 116.84,29.21 107.95,29.21 104.14,33.02 102.87,36.83 99.06,40.64 88.9,43.18 | 88.9,43.18 E11.11 | E11.13 85.09,43.18 88.9,43.18
MB8=0
  Bottom 0.406: U$1.BJ2 116.84,35.56 111.76,35.56 109.22,36.83 105.41,36.83 99.06,43.18 95.25,43.18 E11.9
MB8=1  (via drill 0.81)
  Top 0.406: v100.33,33.02 90.17,33.02 E11.3
  Bottom 0.406: U$1.BN2 116.84,22.86 107.95,22.86 102.87,25.4 v100.33,33.02 | E11.2 E11.3
MB9=0
  Top 0.406: E6.9 E4.6
  Bottom 0.406: U$1.AK2 116.84,102.87 111.76,102.87 109.22,104.14 106.68,104.14 99.06,100.33 67.31,100.33 63.5,96.52 E6.9
MB10=1  (via drill 0.81)
  Top 0.406: U$1.AN1 116.84,92.71 111.76,92.71 v105.41,99.06 | v78.74,50.8 78.74,58.42 | E9.13 81.28,58.42 78.74,58.42 | v76.2,96.52 77.47,95.25 77.47,59.69 78.74,58.42
  Bottom 0.406: v105.41,99.06 99.06,97.79 77.47,97.79 v76.2,96.52 | E10.2 55.88,50.8 v78.74,50.8
MB11=1  (via drill 0.81)
  Top 0.406: U$1.AP1 116.84,90.17 106.68,90.17 102.87,86.36 v102.87,68.58
  Bottom 0.406: E10.12 57.15,63.5 68.58,67.31 99.06,67.31 v102.87,68.58
N$1
  Bottom 0.406: E13.8 93.98,31.75 77.47,31.75 72.39,30.48 68.58,27.94 64.77,27.94 E14.9 E14.10
N$2  (via drill 0.81)
  Top 0.406: E14.8 v66.04,34.29 | E11.5 E11.10
  Bottom 0.406: E11.5 88.9,39.37 82.55,39.37 81.28,38.1 E11.1 72.39,34.29 v66.04,34.29
N$3
  Top 0.406: E11.12 E9.2
  Bottom 0.406: E9.2 E9.1
N$4  (via drill 0.81)
  Top 0.406: E11.8 97.79,45.72 97.79,54.61 E9.10 | v82.55,64.77 78.74,68.58 78.74,105.41 E3.13
  Bottom 0.406: E9.10 90.17,63.5 87.63,64.77 v82.55,64.77 | E3.13 E3.12
N$5
  Top 0.406: E11.6 99.06,41.91 99.06,55.88 E9.9 100.33,67.31 100.33,87.63 101.6,88.9 101.6,91.44 100.33,92.71 100.33,110.49 97.79,113.03 96.52,113.03 E3.9
  Bottom 0.406: E3.9 E3.10
N$6
  Top 0.406: E3.5 E3.8 99.06,107.95 99.06,93.98 97.79,92.71 97.79,82.55 E7.9
  Bottom 0.406: E7.10 E7.9
N$7
  Top 0.406: E7.1 80.01,72.39 80.01,101.6 E3.1 E3.11
  Bottom 0.406: E7.1 E7.2
N$8
  Bottom 0.406: E4.12 55.88,111.76 54.61,113.03 49.53,113.03 48.26,111.76 41.91,111.76 40.64,110.49 39.37,107.95 36.83,105.41 31.75,105.41 R8.1
N$9
  Top 0.406: E3.6 97.79,99.06 97.79,93.98 E5.5
  Bottom 0.406: E5.1 E5.2 83.82,86.36 85.09,85.09 87.63,85.09 88.9,86.36 E5.4 E5.5
N$10
  Top 0.406: E5.12 E3.3
  Bottom 0.406: E5.13 E5.12 88.9,92.71 E5.10 E5.9
N$11  (via drill 0.81)
  Top 0.406: v100.33,35.56 100.33,39.37 102.87,41.91 102.87,54.61 E9.8
  Bottom 0.406: E14.12 58.42,31.75 69.85,31.75 80.01,34.29 97.79,34.29 v100.33,35.56
N$12
  Bottom 0.406: E14.5 E14.4 E14.3
N$13
  Bottom 0.406: E2.4 58.42,118.11 59.69,116.84 85.09,116.84 86.36,118.11 E1.3
N$14
  Bottom 0.406: R10.1 Q3.3 40.64,125.73 52.07,129.54 81.28,129.54 E1.13 E1.12
N$15  (via drill 0.81)
  Top 0.406: E6.10 E4.5 63.5,105.41 66.04,105.41 68.58,102.87 68.58,81.28 69.85,80.01 v69.85,48.26 69.85,21.59 67.31,19.05 55.88,19.05 E14.2
  Bottom 0.406: E9.3 86.36,50.8 82.55,48.26 v69.85,48.26
N$16
  Top 0.406: E2.1 49.53,118.11 49.53,93.98 50.8,92.71 63.5,92.71 E6.8
N$17
  Bottom 0.406: Q3.1 R13.2 Q4.1
N$18
  Bottom 0.406: E4.9 59.69,115.57 57.15,116.84 41.91,116.84 40.64,115.57 40.64,113.03 38.1,107.95 R6.1
N$19  (via drill 0.81)
  Top 0.406: v45.72,115.57 39.37,109.22 39.37,91.44 Q1.2
  Bottom 0.406: Q1.2 35.56,90.17 33.02,92.71 33.02,93.98 R5.2 | E4.10 59.69,113.03 57.15,115.57 v45.72,115.57
N$20  (via drill 0.81)
  Top 0.406: Q2.2 38.1,110.49 41.91,115.57 v43.18,115.57
  Bottom 0.406: R7.2 Q2.2 | E4.11 57.15,113.03 55.88,114.3 48.26,114.3 46.99,113.03 45.72,113.03 v43.18,115.57
N$21
  Top 0.406: E14.6 68.58,26.67 68.58,46.99 67.31,48.26 60.96,48.26 E10.3 E10.11
N$22
  Top 0.406: E10.4 E10.10 48.26,71.12 48.26,78.74 52.07,82.55 58.42,82.55 E6.6
N$23
  Bottom 0.406: R11.2 Q3.2
N$24  (via drill 0.81)
  Top 0.406: U$1.AK1 116.84,102.87 107.95,102.87 v106.68,101.6 | v67.31,97.79 67.31,86.36 60.96,80.01 E8.10 E8.5
  Bottom 0.406: v106.68,101.6 104.14,101.6 99.06,99.06 69.85,99.06 v67.31,97.79 | E8.10 59.69,77.47 54.61,77.47 E8.13
N$25
  Top 0.406: E1.2 E1.11
N$26
  Bottom 0.406: E1.9 E1.10 87.63,130.81 21.59,130.81 13.97,123.19 13.97,102.87 16.51,96.52 D2.C R2.2 C2.1
N$27  (via drill 0.81)
  Top 0.406: v38.1,85.09 39.37,83.82 v39.37,35.56
  Bottom 0.406: E12.3 52.07,34.29 40.64,34.29 v39.37,35.56 | C2.2 30.48,87.63 33.02,85.09 v38.1,85.09
N$28
  Bottom 0.406: R11.1 D5.C R9.2
N$29
  Bottom 0.406: R12.1 31.75,109.22 36.83,109.22 38.1,110.49 Q4.2
N$30
  Top 0.406: E12.2 E12.11
N$31
  Top 0.406: E12.12 58.42,46.99 63.5,46.99 E12.8 E12.5
  Bottom 0.406: E12.13 E12.12
N$32
  Bottom 0.406: E12.9 E12.10 57.15,48.26 29.21,48.26 26.67,50.8 D1.C | C1.1 D1.C | D1.C R1.2
N$33
  Bottom 0.406: C1.2 30.48,46.99 33.02,44.45 33.02,43.18 35.56,40.64 36.83,40.64 41.91,35.56 45.72,35.56 49.53,39.37 62.23,39.37 63.5,38.1 E12.6
N$34
  Bottom 0.406: R23.2 Q7.2
N$35
  Bottom 0.406: Q6.2 36.83,69.85 R20.2
N$36
  Top 0.406: E14.11 E12.4
N$37
  Bottom 0.406: R15.2 38.1,29.21 Q5.2
N$38  (via drill 0.81)
  Top 0.406: v44.45,31.75 v44.45,82.55
  Bottom 0.406: R16.1 R15.1 22.86,41.91 31.75,41.91 35.56,35.56 38.1,33.02 v44.45,31.75 | E8.12 52.07,82.55 v44.45,82.55
N$39
  Bottom 0.406: E8.6 60.96,68.58 43.18,68.58 39.37,72.39 38.1,72.39 31.75,67.31 26.67,67.31 R20.1 R19.1
N$40
  Bottom 0.406: R22.1 R23.1 27.94,81.28 31.75,81.28 34.29,80.01 36.83,80.01 43.18,85.09 59.69,85.09 E8.8
N$41
  Bottom 0.406: Q7.1 33.02,74.93 24.13,74.93 D4.C
N$42
  Bottom 0.406: D3.C 24.13,59.69 31.75,59.69 33.02,60.96 33.02,64.77 Q6.1
N$43  (via drill 0.81)
  Top 0.406: v35.56,16.51 Q5.1
  Bottom 0.406: D7.C 24.13,16.51 v35.56,16.51
N$44
  Bottom 0.406: R18.1 Q5.3 R14.2 | R14.2 R17.2 | D6.C R14.2
N$45
  Bottom 0.406: R21.1 Q6.3
N$46
  Bottom 0.406: R24.1 Q7.3
N$47
  Top 0.406: E9.11 E7.5 E7.12
N$48  (via drill 0.81)
  Top 0.406: R14.1 D8.A | R17.1 29.21,15.24 43.18,15.24 46.99,19.05 v46.99,64.77
  Bottom 0.406: R17.1 R14.1 | U$1.AV2 116.84,73.66 104.14,73.66 99.06,69.85 68.58,69.85 54.61,64.77 v46.99,64.77
N$49
  Top 0.406: E9.12 E9.6
N$50
  Top 0.406: U$1.BB1 116.84,54.61 110.49,54.61 101.6,63.5 101.6,86.36 102.87,87.63 102.87,92.71 101.6,93.98 101.6,119.38 106.68,124.46 116.84,124.46 U$1.AB1
SKIP_L  (via drill 0.81)
  Top 0.406: v39.37,19.05 38.1,22.86 36.83,24.13 36.83,55.88 33.02,59.69 33.02,90.17 Q1.3
  Bottom 0.406: U$1.BR2 116.84,16.51 43.18,16.51 v39.37,19.05
VCC
  Top 0.813: R10.2 22.86,128.27 39.37,128.27 C9.1 45.72,119.38 43.18,116.84 Q4.3 | C8.1 74.93,123.19 74.93,111.76 C10.1 74.93,106.68 74.93,99.06 73.66,97.79 C12.1 76.2,90.17 76.2,80.01 C14.1 76.2,74.93 76.2,60.96 C16.1 76.2,55.88 76.2,45.72 C18.1 76.2,40.64 76.2,29.21 C20.1 | R22.2 D4.A 27.94,69.85 27.94,64.77 R19.2 D3.A 33.02,54.61 33.02,46.99 R16.2 27.94,41.91 20.32,41.91 17.78,39.37 17.78,22.86 D9.C
  Bottom 0.813: C11.1 E4.14 50.8,109.22 52.07,107.95 67.31,107.95 C10.1 E3.14 | U$1.AA2 116.84,128.27 107.95,128.27 C6.+ 99.06,124.46 82.55,124.46 81.28,125.73 E1.14 C8.1 71.12,124.46 52.07,124.46 50.8,125.73 E2.14 C9.1 | C19.1 E12.14 50.8,43.18 52.07,41.91 68.58,41.91 C18.1 E11.14 | C13.1 E6.14 50.8,93.98 52.07,92.71 C12.1 E5.14 | C15.1 E8.14 50.8,77.47 52.07,76.2 68.58,76.2 C14.1 E7.14 | C21.1 E14.14 50.8,27.94 52.07,26.67 C20.1 E13.14 | U$1.BA2 116.84,58.42 104.14,58.42 | 104.14,58.42 82.55,58.42 81.28,59.69 E9.14 C16.1 52.07,58.42 50.8,59.69 E10.14 C17.1 C7.+ 35.56,60.96 31.75,57.15 D3.A | R10.2 17.78,123.19 17.78,110.49 R6.2 R8.2 | D9.C D7.A | 104.14,58.42 C22.+
Z_AXIS  (via drill 0.81)
  Top 0.406: v100.33,116.84 100.33,127 96.52,130.81 17.78,130.81 13.97,127 13.97,90.17 R24.2 | D9.A 33.02,22.86 33.02,27.94 D6.A
  Bottom 0.406: U$1.AE2 116.84,115.57 110.49,115.57 107.95,118.11 101.6,118.11 v100.33,116.84 | R24.2 17.78,81.28 17.78,71.12 R21.2 17.78,66.04 17.78,39.37 R18.2 D8.C D6.A

### Text on the board
Bottom: M701D